# Altium schematic sheet 主控.SchDoc
size A4
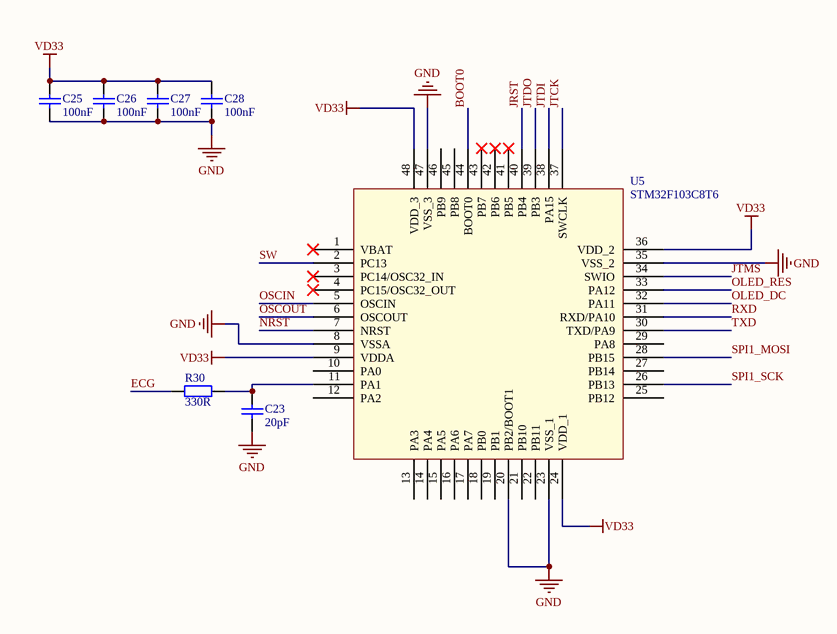
[diagram p0: 主控.SchDoc]

## Parts
C23  20pF  [LC-0805_C]
C25  100nF  [LC-0805_C]
C26  100nF  [LC-0805_C]
C27  100nF  [LC-0805_C]
C28  100nF  [LC-0805_C]
R30  330R  [LC-0805_R]
U5  STM32F103C8T6  [LQFP48]

## Nets
GND: C23.2 C25.2 C26.2 C27.2 C28.2 U5.8(VSSA) U5.20(PB2/BOOT1) U5.23(VSS_1) U5.35(VSS_2) U5.47(VSS_3)
VD33: C25.1 C26.1 C27.1 C28.1 U5.9(VDDA) U5.24(VDD_1) U5.36(VDD_2) U5.48(VDD_3)
BOOT0: U5.44(BOOT0)
ECG: R30.1
JRST: U5.40(PB4)
JTCK: U5.37(SWCLK)
JTDI: U5.38(PA15)
JTDO: U5.39(PB3)
JTMS: U5.34(SWIO)
NRST: U5.7(NRST)
OLED_DC: U5.32(PA11)
OLED_RES: U5.33(PA12)
OSCIN: U5.5(OSCIN)
OSCOUT: U5.6(OSCOUT)
RXD: U5.31(RXD/PA10)
SPI1_MOSI: U5.28(PB15)
SPI1_SCK: U5.26(PB13)
SW: U5.2(PC13)
TXD: U5.30(TXD/PA9)
NetC23_1: C23.1 R30.2 U5.11(PA1)

Not connected (* = marked no-connect by the designer): U5 1(VBAT)* 3(PC14/OSC32_IN)* 4(PC15/OSC32_OUT)* 10(PA0) 12(PA2) 13(PA3) 14(PA4) 15(PA5) 16(PA6) 17(PA7) 18(PB0) 19(PB1) 21(PB10) 22(PB11) 25(PB12) 27(PB14) 29(PA8) 41(PB5)* 42(PB6)* 43(PB7)* 45(PB8) 46(PB9)

## Library data of the parts
C23 C25-C28 = Cap: 100nF��0805��50V,+/-10%
R30 = Res1: 330��,0805,��5%
U5 = STM32F103C8T6: STM32F103C8T6,LQFP48